# Altium schematic sheet Sheet2.SchDoc
size A
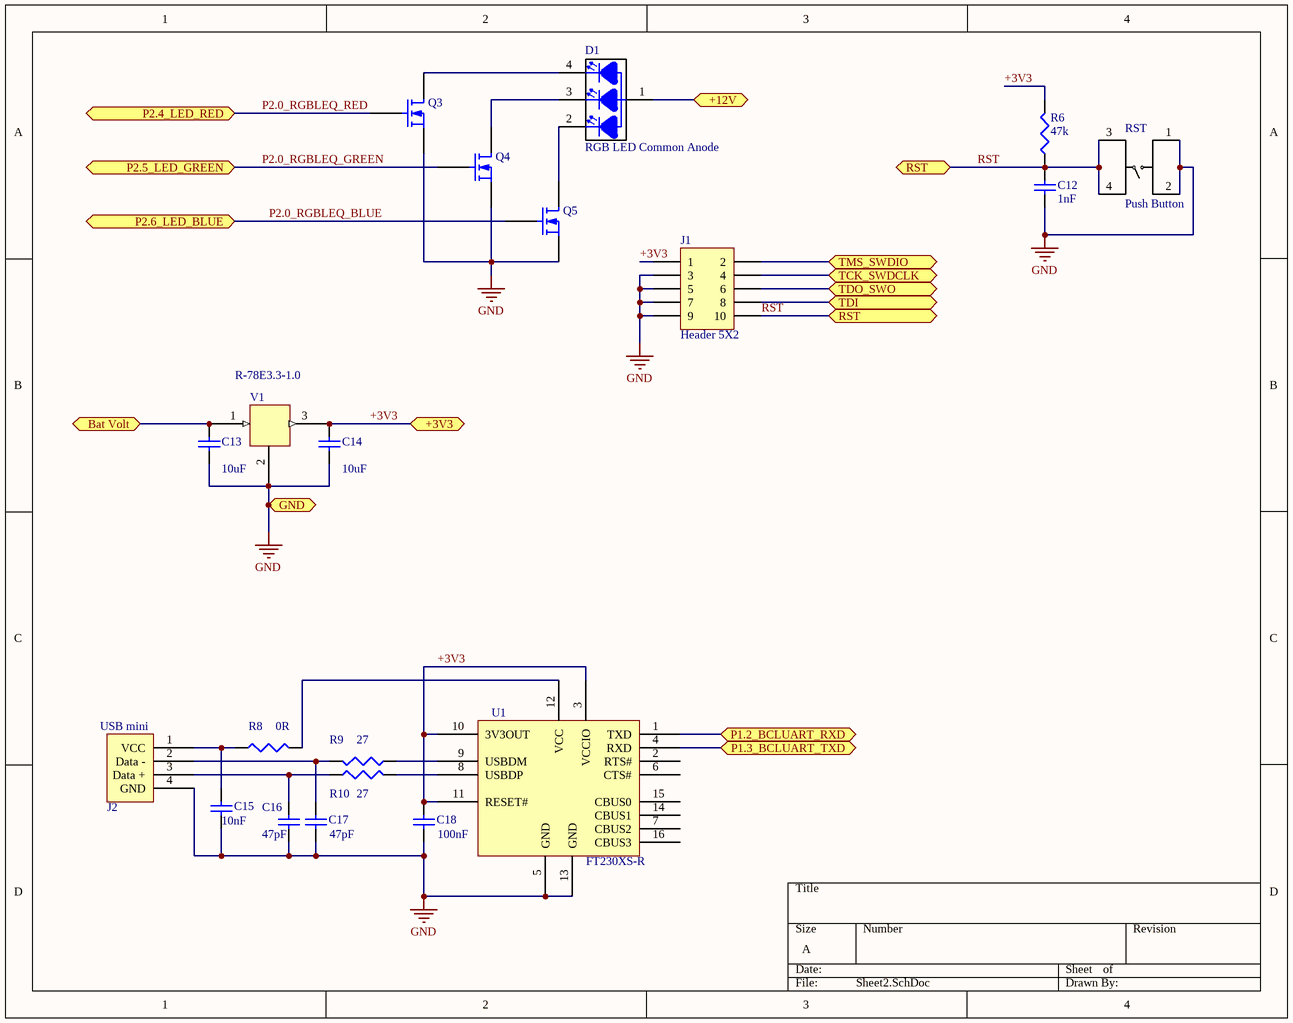
[diagram p0: Sheet2.SchDoc]

## Parts
C12  value 1nF  [0402]  (hidden comment: Cap Semi)
C13  value 10uF  [6-0805_L]  (hidden comment: Cap)
C14  value 10uF  [6-0805_L]  (hidden comment: Cap)
C15  value 10nF  [0603]  (hidden comment: Cap)
C16  value 47pF  [0402]  (hidden comment: Cap)
C17  value 47pF  [0402]  (hidden comment: Cap)
C18  value 100nF  [0402]  (hidden comment: Cap)
D1  RGB LED Common Anode  [HDR1X4]
J1  Header 5X2  [JTAG Header]
J2  USB mini  [USB mini B]
Q3  MOSFET-N  [DMN1019USN]  (value not drawn)
Q4  MOSFET-N  [DMN1019USN]  (value not drawn)
Q5  MOSFET-N  [DMN1019USN]  (value not drawn)
R6  value 47k  [J1-0603]  (hidden comment: Res3)
R8  value 0R  [J1-0603]  (hidden comment: Res3)
R9  value 27  [J1-0603]  (hidden comment: Res3)
R10  value 27  [J1-0603]  (hidden comment: Res3)
RST  Push Button  [Push Button]
U1  FT230XS-R  [SOP64P600X175-16N]
V1  R-78E3.3-1.0  [R-78E-0.5]

## Ports
+3V3, +12V, Bat Volt, GND, P1.2_BCLUART_RXD, P1.3_BCLUART_TXD, P2.4_LED_RED, P2.5_LED_GREEN, P2.6_LED_BLUE, RST, TCK_SWDCLK, TDI, TDO_SWO, TMS_SWDIO

## Nets
GND: C12.1 C13.1 C14.1 C15.1 C16.1 C17.1 C18.1 J1.3 J1.5 J1.7 J1.9 J2.4(GND) Q3.2(S) Q4.2(S) Q5.2(S) RST.1 RST.2 U1.5(GND) U1.13(GND) V1.2(GND) ; port GND
+3V3: C14.2 C18.2 J1.1 R6.2 U1.3(VCCIO) U1.10(3V3OUT) U1.11(RESET#) V1.3(Vout) ; port +3V3
+12V: D1.1 ; port +12V
Bat Volt: C13.2 V1.1(Vin) ; port Bat Volt
P1.2_BCLUART_RXD: U1.1(TXD) ; port P1.2_BCLUART_RXD
P1.3_BCLUART_TXD: U1.4(RXD) ; port P1.3_BCLUART_TXD
P2.0_RGBLEQ_BLUE: Q5.1(G) ; port P2.6_LED_BLUE
P2.0_RGBLEQ_GREEN: Q4.1(G) ; port P2.5_LED_GREEN
P2.0_RGBLEQ_RED: Q3.1(G) ; port P2.4_LED_RED
RST: C12.2 J1.10 R6.1 RST.3 RST.4 ; port RST
TCK_SWDCLK: J1.4 ; port TCK_SWDCLK
TDI: J1.8 ; port TDI
TDO_SWO: J1.6 ; port TDO_SWO
TMS_SWDIO: J1.2 ; port TMS_SWDIO
NetC15_2: C15.2 J2.1(VCC) R8.1
NetC16_2: C16.2 J2.3(Data_+) R10.1
NetC17_2: C17.2 J2.2(Data_-) R9.2
NetD1_2: D1.2 Q5.3(D)
NetD1_3: D1.3 Q4.3(D)
NetD1_4: D1.4 Q3.3(D)
NetR8_2: R8.2 U1.12(VCC)
NetR9_1: R9.1 U1.9(USBDM)
NetR10_2: R10.2 U1.8(USBDP)

Not connected (* = marked no-connect by the designer): U1 2(RTS#) 6(CTS#) 7(CBUS2) 14(CBUS1) 15(CBUS0) 16(CBUS3)

## Library data of the parts
C12 = Cap Semi: Capacitor (Semiconductor SIM Model); Published: 8-Jun-2000; LatestRevisionDate: 29-May-2009; LatestRevisionNote: IPC-7351 Footprint Added.; PackageReference: C1206; Publisher: Altium Limited; PackageDescription: Chip Capacitor; Supplier 1: Digi-Key; Supplier Part Number 1: 490-4761-1-ND
C13-C18 = Cap: Capacitor; Published: 8-Jun-2000; LatestRevisionDate: 17-Jul-2002; LatestRevisionNote: Re-released for DXP Platform.; PackageReference: RAD-0.3; Publisher: Altium Limited; PackageDescription: Radial Cap, Thru-Hole; 2 Leads; 0.3 in Pin Spacing; Supplier 1: Digi-Key
  C13 C14: Supplier Part Number 1: 1276-2872-1-ND
  C15: Supplier Part Number 1: 1276-1921-1-ND
  C16 C17: Supplier Part Number 1: 490-16375-1-ND
  C18: Supplier Part Number 1: 1276-1001-1-ND
J1 = Header 5X2: Header, 5-Pin, Dual row; LatestRevisionDate: 17-Jul-2002; LatestRevisionNote: Re-released for DXP Platform.; Publisher: Altium Limited
J2 = USB Port: Supplier 1: Digi-Key; Supplier Part Number 1: 151-1206-1-ND
Q3-Q5 = N-Channel MOSFET: Supplier 1: Digi-Key; Supplier Part Number 1: DMN1019USN-7DICT-ND
R6 R8-R10 = Res3: Resistor; Published: 8-Jun-2000; LatestRevisionDate: 29-May-2009; LatestRevisionNote: IPC-7351 Footprint Added.; PackageReference: J1-0603; Publisher: Altium Limited; PackageDescription: Chip Resistor
V1 = R-78E3.3-1.0: DC DC converter; Supplier 1: Digi-Key; Supplier Part Number 1: 945-2409-5-ND
RST = Push Button: Supplier 1: Digi-Key; Supplier Part Number 1: 450-1157-ND
U1 = FT230XS-R: Supplier 1: Digi-Key; Supplier Part Number 1: 768-1135-1-ND